# Altium project DriveTrainDaqBoard.PrjPcb
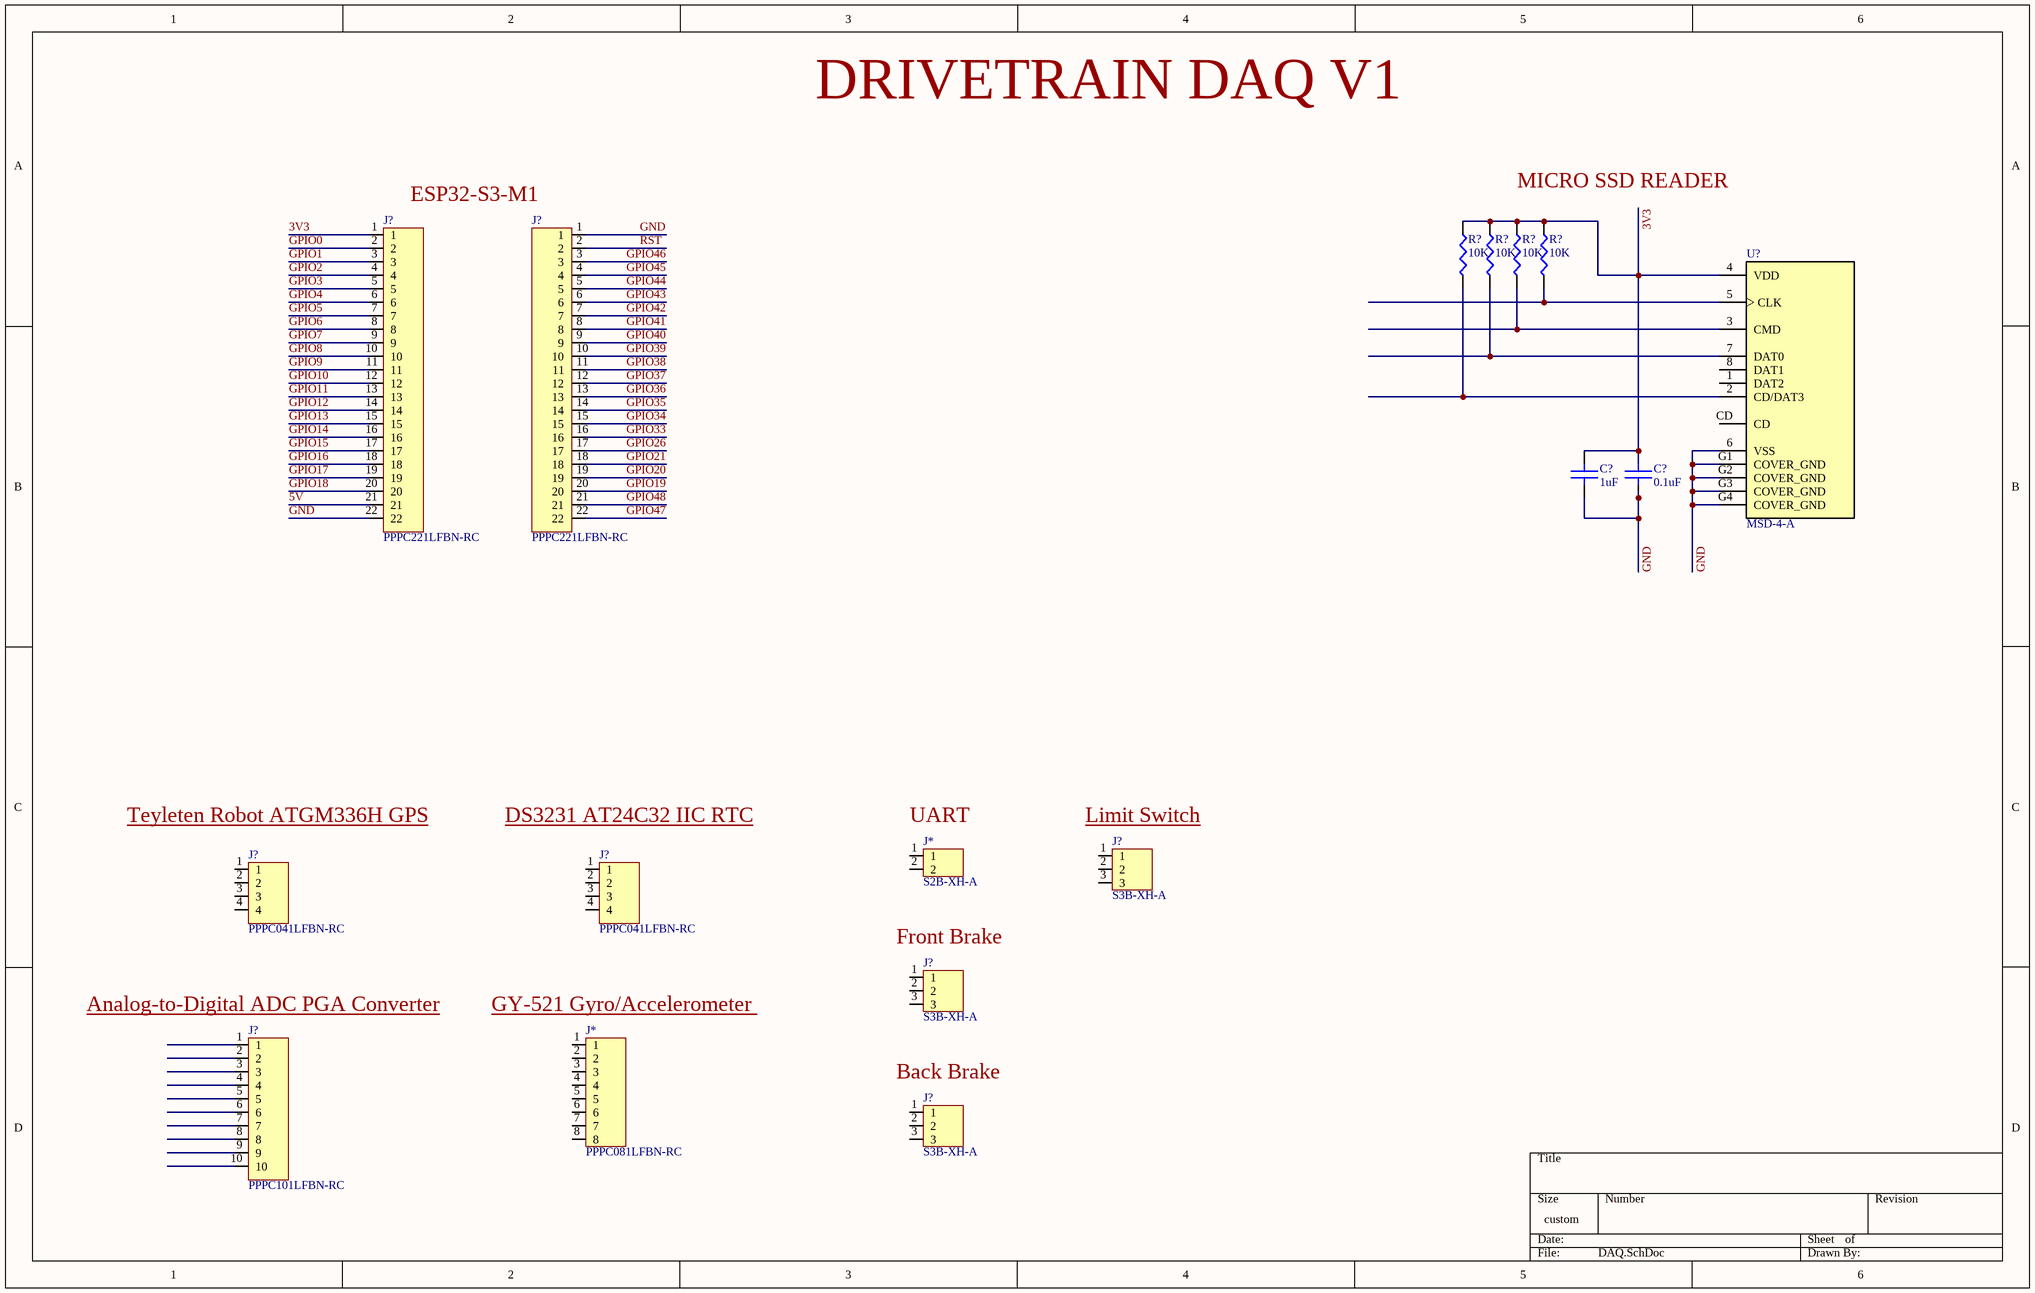
[diagram p0: DAQ.SchDoc]
1 sheet, 17 parts. Net scope: global (net labels, ports and power ports of the same name join across sheets).
Board file: DAQ.PcbDoc

## Sheet DAQ.SchDoc
size 381 x 241 mm; SheetNumber: 1; SheetTotal: 1

### Parts
(Parts that share a designator on the sheet are numbered #1, #2 ... from top to bottom, then left to right.)
C?#1  1uF  [CAPC1005X65N]
C?#2  0.1uF  [CAPC1005X65N]
J*#1  S2B-XH-A  [JST_S2B-XH-A]
J*#2  PPPC081LFBN-RC  [PPPC081LFBN-RC]
J?#1  PPPC221LFBN-RC  [PPPC221LFBN-RC]
J?#2  PPPC221LFBN-RC  [PPPC221LFBN-RC]
J?#3  S3B-XH-A  [JST_S3B-XH-A]
J?#4  S3B-XH-A  [JST_S3B-XH-A]
J?#5  PPPC041LFBN-RC  [PPPC041LFBN-RC]
J?#6  PPPC041LFBN-RC  [PPPC041LFBN-RC]
J?#7  S3B-XH-A  [JST_S3B-XH-A]
J?#8  PPPC101LFBN-RC  [PPPC101LFBN-RC]
R?#1  10K  [RESC1005X37N]
R?#2  10K  [RESC1005X37N]
R?#3  10K  [RESC1005X37N]
R?#4  10K  [RESC1005X37N]
U?  MSD-4-A  [CUI_MSD-4-A]

### Nets
3V3: C?#1.2 C?#2.2 J?#1.1 R?#1.2 R?#2.2 R?#3.2 R?#4.2 U?.4(VDD)
5V: J?#1.21
GND: C?#1.1 C?#2.1 J?#1.22 J?#2.1 U?.6(VSS) U?.G1(COVER_GND) U?.G2(COVER_GND) U?.G3(COVER_GND) U?.G4(COVER_GND)
GPIO0: J?#1.2
GPIO1: J?#1.3
GPIO2: J?#1.4
GPIO3: J?#1.5
GPIO4: J?#1.6
GPIO5: J?#1.7
GPIO6: J?#1.8
GPIO7: J?#1.9
GPIO8: J?#1.10
GPIO9: J?#1.11
GPIO10: J?#1.12
GPIO11: J?#1.13
GPIO12: J?#1.14
GPIO13: J?#1.15
GPIO14: J?#1.16
GPIO15: J?#1.17
GPIO16: J?#1.18
GPIO17: J?#1.19
GPIO18: J?#1.20
GPIO19: J?#2.20
GPIO20: J?#2.19
GPIO21: J?#2.18
GPIO26: J?#2.17
GPIO33: J?#2.16
GPIO34: J?#2.15
GPIO35: J?#2.14
GPIO36: J?#2.13
GPIO37: J?#2.12
GPIO38: J?#2.11
GPIO39: J?#2.10
GPIO40: J?#2.9
GPIO41: J?#2.8
GPIO42: J?#2.7
GPIO43: J?#2.6
GPIO44: J?#2.5
GPIO45: J?#2.4
GPIO46: J?#2.3
GPIO47: J?#2.22
GPIO48: J?#2.21
RST: J?#2.2
NetR?#1_1: R?#1.1 U?.2(CD/DAT3)
NetR?#2_1: R?#2.1 U?.7(DAT0)
NetR?#3_1: R?#3.1 U?.3(CMD)
NetR?#4_1: R?#4.1 U?.5(CLK)

Not connected (* = marked no-connect by the designer): J*#1 1 2; J*#2 1 2 3 4 5 6 7 8; J?#3 1 2 3; J?#4 1 2 3; J?#5 1 2 3 4; J?#6 1 2 3 4; J?#7 1 2 3; J?#8 1 2 3 4 5 6 7 8 9 10; U? 1(DAT2) 8(DAT1) CD

### Notes on the sheet
- DRIVETRAIN DAQ V1
- (near J?#1) ESP32-S3-M1
- (near R?#3) MICRO SSD READER
- (near J?#5) Teyleten Robot ATGM336H GPS <https://www.amazon.com/dp/B09LQDG1HY?ref=cm_sw_r_cso_cp_apin_dp_BQDS0HH5JQXGPHMCTJB1&ref_=cm_sw_r_cso_cp_apin_dp_BQDS0HH5JQXGPHMCTJB1&social_share=cm_sw_r_cso_cp_apin_dp_BQDS0HH5JQXGPHMCTJB1&titleSource=true>
- (near J?#6) DS3231 AT24C32 IIC RTC <https://www.amazon.com/dp/B07Q7NZTQS?ref=cm_sw_r_cso_cp_apin_dp_KZP2DNHVS5H5VK4BXDW1&ref_=cm_sw_r_cso_cp_apin_dp_KZP2DNHVS5H5VK4BXDW1&social_share=cm_sw_r_cso_cp_apin_dp_KZP2DNHVS5H5VK4BXDW1&titleSource=true&th=1>
- (near J*#1) UART
- (near J?#3) Limit Switch <https://a.co/d/0eUTMwXj>
- (near J?#4) Front Brake
- (near J?#8) Analog-to-Digital ADC PGA Converter <https://www.amazon.com/WWZMDiB-ADS1115-Converter-Raspberry-Experiments/dp/B0C8JFZ3D9>
- (near J*#2) GY-521 Gyro/Accelerometer <https://www.amazon.com/dp/B00LP25V1A?ref=cm_sw_r_cso_cp_apin_dp_01VYWEK9JFS8N8HQ5ARK&ref_=cm_sw_r_cso_cp_apin_dp_01VYWEK9JFS8N8HQ5ARK&social_share=cm_sw_r_cso_cp_apin_dp_01VYWEK9JFS8N8HQ5ARK&titleSource=true&th=1>
- (near J?#7) Back Brake

### Library data of the parts
C?#1 = CL05A105KO5NNNC: CAP CER 1UF 16V X5R 0402; Manufacturer: Samsung Electro-Mechanics; Value: 1µF; Dielectric Material: Ceramic; Tolerance: 10%; Supplier: DigiKey; Supplier Part Number: 1276-1067-1-ND; Manufacturer Part Number: CL05A105KO5NNNC; RoHS: Compliant; Category: Ceramic Capacitors; Stock: 473216; Pricing: 1=0.08, 10=0.006, 50=0.006 (USD); Case/Package: 0402; Case Code (Imperial): 0402; Case Code (Metric): 1005; China RoHS: Compliant; Contact Plating: Tin; Depth: 500µm; Dielectric: X5R; Height: 550µm; Length: 1mm; Lifecycle Status: Production; Material: Ceramic; Max Operating Temperature: 85°C; Min Operating Temperature: -55°C; Mounting Technology: Surface Mount; Number of Terminals: 2; Radiation Hardening: No; REACH SVHC: Yes; Schedule B: 8532240020, 8532240020|8532240020, 8532240020|8532240020|8532240020, 8532240020|8532240020|8532240020|8532240020; Thickness: 558.8µm; Voltage: 16V; Voltage Rating: 16V; Voltage Rating (DC): 16V; Width: 500µm; ComponentLink1URL: https://datasheet.octopart.com:443/CL05A105KO5NNNC-Samsung-Electro-Mechanics-datasheet-181960514.pdf?src-supplier=IHS; ComponentLink1Description: https://datasheet.octopart.com:443/CL05A105KO5NNNC-Samsung-Electro-Mechanics-datasheet-181960514.pdf?src-supplier=IHS; ComponentLink2URL: https://datasheet.octopart.com:443/CL05A105KO5NNNC-Samsung-Electro-Mechanics-datasheet-136031720.pdf?src-supplier=Samsung+SCT; ComponentLink2Description: https://datasheet.octopart.com:443/CL05A105KO5NNNC-Samsung-Electro-Mechanics-datasheet-136031720.pdf?src-supplier=Samsung+SCT; ComponentLink3URL: https://datasheet.octopart.com:443/CL05A105KO5NNNC-Samsung-Electro-Mechanics-datasheet-11776774.pdf?src-supplier=Future+Electronics; ComponentLink3Description: https://datasheet.octopart.com:443/CL05A105KO5NNNC-Samsung-Electro-Mechanics-datasheet-11776774.pdf?src-supplier=Future+Electronics; ComponentLink4URL: https://datasheet.octopart.com:443/CL05A105KO5NNNC-Samsung-Electro-Mechanics-datasheet-110226202.pdf?src-supplier=Future+Electronics; ComponentLink4Description: https://datasheet.octopart.com:443/CL05A105KO5NNNC-Samsung-Electro-Mechanics-datasheet-110226202.pdf?src-supplier=Future+Electronics; ComponentLink5URL: https://datasheet.octopart.com:443/CL05A105KO5NNNC-Samsung-Electro-Mechanics-datasheet-81461590.pdf?src-supplier=Future+Electronics; ComponentLink5Description: https://datasheet.octopart.com:443/CL05A105KO5NNNC-Samsung-Electro-Mechanics-datasheet-81461590.pdf?src-supplier=Future+Electronics; ComponentLink6URL: https://datasheet.octopart.com:443/CL05A105KO5NNNC-Samsung-datasheet-42280519.pdf?src-supplier=Future+Electronics; ComponentLink6Description: https://datasheet.octopart.com:443/CL05A105KO5NNNC-Samsung-datasheet-42280519.pdf?src-supplier=Future+Electronics; ComponentLink7URL: https://datasheet.octopart.com:443/CL05A105KO5NNNC-Samsung-datasheet-34152987.pdf?src-supplier=Future+Electronics; ComponentLink7Description: https://datasheet.octopart.com:443/CL05A105KO5NNNC-Samsung-datasheet-34152987.pdf?src-supplier=Future+Electronics; ComponentLink8URL: https://datasheet.octopart.com:443/CL05A105KO5NNNC-Samsung-datasheet-8329584.pdf?src-supplier=Future+Electronics; ComponentLink8Description: https://datasheet.octopart.com:443/CL05A105KO5NNNC-Samsung-datasheet-8329584.pdf?src-supplier=Future+Electronics; ComponentLink9URL: https://datasheet.octopart.com:443/CL05A105KO5NNNC-Samsung-Electro-Mechanics-datasheet-149136633.pdf?src-supplier=Future+Electronics; ComponentLink9Description: https://datasheet.octopart.com:443/CL05A105KO5NNNC-Samsung-Electro-Mechanics-datasheet-149136633.pdf?src-supplier=Future+Electronics; ComponentLink10URL: https://datasheet.octopart.com/CL05A105KO5NNNC-Samsung-Electro-Mechanics-datasheet-97040617.pdf; ComponentLink10Description: https://datasheet.octopart.com/CL05A105KO5NNNC-Samsung-Electro-Mechanics-datasheet-97040617.pdf; ComponentLink11URL: https://datasheet.octopart.com/CL05A105KO5NNNC-Samsung-Electro-Mechanics-datasheet-8324245.pdf; ComponentLink11Description: https://datasheet.octopart.com/CL05A105KO5NNNC-Samsung-Electro-Mechanics-datasheet-8324245.pdf; ComponentLink12URL: https://datasheet.octopart.com/General-Multilayer-Ceramic-Capacitors-Samsung-datasheet-family-111.pdf; ComponentLink12Description: https://datasheet.octopart.com/General-Multilayer-Ceramic-Capacitors-Samsung-datasheet-family-111.pdf; ComponentLink13URL: https://datasheet.octopart.com:443/CL05A105KO5NNNC-Samsung-datasheet-59220082.pdf?src-supplier=TME; ComponentLink13Description: https://datasheet.octopart.com:443/CL05A105KO5NNNC-Samsung-datasheet-59220082.pdf?src-supplier=TME; ComponentLink14URL: http://sigma.octopart.com:80/rohs_certificate/General-Multilayer-Ceramic-Capacitors-Samsung-family-110.pdf?src-supplier=Compliance+Statements; ComponentLink14Description: http://sigma.octopart.com:80/rohs_certificate/General-Multilayer-Ceramic-Capacitors-Samsung-family-110.pdf?src-supplier=Compliance+Statements; ComponentLink15URL: http://sigma.octopart.com:80/rohs_statement/General-Multilayer-Ceramic-Capacitors-Samsung-family-132.pdf?src-supplier=Compliance+Statements; ComponentLink15Description: http://sigma.octopart.com:80/rohs_statement/General-Multilayer-Ceramic-Capacitors-Samsung-family-132.pdf?src-supplier=Compliance+Statements; ComponentLink16URL: http://sigma.octopart.com:80/reach_statement/General-Multilayer-Ceramic-Capacitors-Samsung-family-133.pdf?src-supplier=Compliance+Statements; ComponentLink16Description: http://sigma.octopart.com:80/reach_statement/General-Multilayer-Ceramic-Capacitors-Samsung-family-133.pdf?src-supplier=Compliance+Statements; LCSC Part Number: C29266
C?#2 = CL05B104KB5NNNC: CAP CER 0.1UF 50V X7R 0402; Manufacturer: Samsung Electro-Mechanics; Value: 100nF; Dielectric Material: Ceramic; Tolerance: 10%; Supplier: DigiKey; Supplier Part Number: 1276-CL05B104KB5NNNCCT-ND; Manufacturer Part Number: CL05B104KB5NNNC; RoHS: Compliant; Category: Ceramic Capacitors; Stock: 758316; Pricing: 1=0.08, 10=0.010, 50=0.0088, 100=0.008 (USD); Case/Package: 0402; China RoHS: Compliant; Dielectric: X7R; Height: 550µm; Lifecycle Status: Production; Material: Ceramic; Max Operating Temperature: 125°C; Min Operating Temperature: -55°C; Mounting Technology: Surface Mount; Number of Terminals: 2; REACH SVHC: Yes; Voltage Rating: 50V; Voltage Rating (DC): 50V; ComponentLink1URL: https://datasheet.octopart.com:443/CL05B104KB5NNNC-Samsung-Electro-Mechanics-datasheet-141346860.pdf?src-supplier=IHS; ComponentLink1Description: https://datasheet.octopart.com:443/CL05B104KB5NNNC-Samsung-Electro-Mechanics-datasheet-141346860.pdf?src-supplier=IHS; ComponentLink2URL: https://datasheet.octopart.com:443/CL05B104KB5NNNC-Samsung-datasheet-97040617.pdf?src-supplier=Future+Electronics; ComponentLink2Description: https://datasheet.octopart.com:443/CL05B104KB5NNNC-Samsung-datasheet-97040617.pdf?src-supplier=Future+Electronics; ComponentLink3URL: https://datasheet.octopart.com:443/CL05B104KB5NNNC-Samsung-datasheet-8326407.pdf?src-supplier=TME; ComponentLink3Description: https://datasheet.octopart.com:443/CL05B104KB5NNNC-Samsung-datasheet-8326407.pdf?src-supplier=TME; LCSC Part Number: C960916; Parameter 2: *
J*#1 = S2B-XH-A: Board Connector, 2 Contact(s), 1 Row(s), Male, Right Angle, Solder Terminal; Manufacturer: JST; Contact Resistance: 20mΩ; Current Rating: 3A; Insulation Resistance: 1GΩ; Number of Poles: 2; Pitch: 2.5mm; Supplier: DigiKey; Supplier Part Number: 455-S2B-XH-A-ND; Manufacturer Part Number: S2B-XH-A; RoHS: Compliant; Category: Card Edge Connectors; Stock: 27070; Pricing: 1=0.14, 10=0.12, 100=0.1019, 500=0.09094, 1000=0.08658, 5000=0.07728, 10000=0.07359 (USD); Color: White; Contact Material: Bronze; Contact Plating: Copper, Lead, Tin; Export Control Classification Number (ECCN) Code: EAR99; Gender: Male; Height: 6.1mm; Harmonized Tariff Schedule (HTS) Code: 8536.69.40.40; Introduction Date: 1997-11-01; Length: 7.4mm; Lifecycle Status: Production; Max Operating Temperature: 85°C; Min Operating Temperature: -25°C; Mounting Technology: Through Hole; Number of Positions: 2; Number of Rows: 1; Terminal Pitch: 2.5mm; Width: 11.5mm; ComponentLink1URL: https://datasheet.octopart.com:443/S2B-XH-A-JST-datasheet-157850277.pdf?src-supplier=IHS; ComponentLink1Description: https://datasheet.octopart.com:443/S2B-XH-A-JST-datasheet-157850277.pdf?src-supplier=IHS
J*#2 = PPPC081LFBN-RC: CONN HDR 8POS 0.1 GOLD PCB; Manufacturer: Sullins; Description: Female, 8C, Straight, .100"CC; 3.20mm Tail, No Mounting; PBT, Phos. Bronze, 105 C; Connector Type: Header, Socket; Current Rating: 3A; Dielectric Material: Polyester; Gender: Female; Number of Contacts: 8; Pitch: 2.54mm; Voltage Rating: 250V; Supplier: DigiKey; Supplier Part Number: S7041-ND; Manufacturer Part Number: PPPC081LFBN-RC; RoHS: Compliant; Category: Headers and Wire Housings; Stock: 10969; Pricing: 1=0.6, 10=0.509, 100=0.4323, 500=0.38584, 1000=0.3674, 5000=0.32795, 10000=0.31231 (USD); Case/Package: TO-252-3; Color: Black; Contact Material: Gold, Nickel; Contact Plating: Gold; Export Control Classification Number (ECCN) Code: EAR99; Height: 2.39mm; Housing Material: Plastic; Harmonized Tariff Schedule (HTS) Code: 8536.69.40.40; Introduction Date: 2008-05-14; Lead Free: Lead Free; Length: 6.73mm; Lifecycle Status: Production; Max Operating Temperature: 105°C; Min Operating Temperature: -40°C; Mounting Technology: Surface Mount; Number of Positions: 8; Number of Rows: 1; Packaging: Tape and Reel; Radiation Hardening: No; REACH SVHC: Yes; Terminal Pitch: 2.54mm; Termination: Solder; Width: 6.22mm; ComponentLink1URL: https://datasheet.octopart.com:443/PPPC081LFBN-RC-Sullins-datasheet-138810743.pdf?src-supplier=IHS; ComponentLink1Description: https://datasheet.octopart.com:443/PPPC081LFBN-RC-Sullins-datasheet-138810743.pdf?src-supplier=IHS; ComponentLink2URL: https://datasheet.octopart.com:443/PPPC081LFBN-RC-Sullins-datasheet-41308905.pdf?src-supplier=Upverter; ComponentLink2Description: https://datasheet.octopart.com:443/PPPC081LFBN-RC-Sullins-datasheet-41308905.pdf?src-supplier=Upverter; ComponentLink3URL: https://sigma.octopart.com:443/83216130/technical_drawing/Sullins-PPPC081LFBN-RC.pdf?src-supplier=Upverter; ComponentLink3Description: https://sigma.octopart.com:443/83216130/technical_drawing/Sullins-PPPC081LFBN-RC.pdf?src-supplier=Upverter; ComponentLink4URL: https://datasheet.octopart.com:443/PPPC081LFBN-RC-Sullins-datasheet-12511165.pdf?src-supplier=Future+Electronics; ComponentLink4Description: https://datasheet.octopart.com:443/PPPC081LFBN-RC-Sullins-datasheet-12511165.pdf?src-supplier=Future+Electronics
J?#1 J?#2 = PPPC221LFBN-RC: 22 Position 1 Row 2.54 mm Pitch Through Hole Female Socket Through Hole Header; Manufacturer: Sullins; Connector Type: Header, Socket; Current Rating: 3A; Dielectric Material: Polyester; Number of Positions: 22; Pitch: 2.54mm; Supplier: DigiKey; Supplier Part Number: S7055-ND; Manufacturer Part Number: PPPC221LFBN-RC; RoHS: Compliant; Category: Card Edge Connectors; Stock: 1982; Pricing: 1=1.24, 10=1.056, 100=0.8975, 500=0.8011, 1000=0.76285, 5000=0.6994 (USD); Color: Black; Contact Gender: Female; Contact Material: Bronze; Contact Plating: Gold; Height: 8.5mm; Housing Material: Plastic; Lead Free: Lead Free; Length: 56.4mm; Lifecycle Status: Production; Mounting Technology: Through Hole; Pins: 22; Number of Rows: 1; Packaging: Bulk; REACH SVHC: Yes; Terminal Pitch: 2.54mm; Termination: Solder; Width: 2.5mm; ComponentLink1URL: https://datasheet.octopart.com:443/PPPC221LFBN-RC-Sullins-datasheet-138810743.pdf?src-supplier=IHS; ComponentLink1Description: https://datasheet.octopart.com:443/PPPC221LFBN-RC-Sullins-datasheet-138810743.pdf?src-supplier=IHS; ComponentLink2URL: https://datasheet.octopart.com:443/PPPC221LFBN-RC-Sullins-datasheet-47864048.pdf?src-supplier=Future+Electronics; ComponentLink2Description: https://datasheet.octopart.com:443/PPPC221LFBN-RC-Sullins-datasheet-47864048.pdf?src-supplier=Future+Electronics; ComponentLink3URL: https://datasheet.octopart.com:443/PPPC221LFBN-RC-Sullins-datasheet-12511165.pdf?src-supplier=Factory+Futures; ComponentLink3Description: https://datasheet.octopart.com:443/PPPC221LFBN-RC-Sullins-datasheet-12511165.pdf?src-supplier=Factory+Futures
J?#3 J?#4 J?#7 = S3B-XH-A: Board Connector, 3 Contact(s), 1 Row(s), Male, Right Angle, Solder Terminal; Manufacturer: JST; Contact Resistance: 20mΩ; Current Rating: 3A; Insulation Resistance: 1GΩ; Number of Contacts: 3; Supplier: DigiKey; Supplier Part Number: 455-S3B-XH-A-ND; Manufacturer Part Number: S3B-XH-A; RoHS: Compliant; Category: Card Edge Connectors; Stock: 62900; Pricing: 1=0.15, 10=0.126, 100=0.1068, 500=0.09526, 1000=0.09071, 5000=0.08096, 10000=0.07709 (USD); Contact Gender: Male; Contact Material: Brass; Contact Plating: Tin; Gender: Male; Lifecycle Status: Production; Max Operating Temperature: 85°C; Min Operating Temperature: -25°C; Pins: 3; Number of Rows: 1; REACH SVHC: No; Terminal Pitch: 2.5mm; Termination: Through Hole; ComponentLink1URL: https://datasheet.octopart.com:443/S3B-XH-A-JST-datasheet-157850277.pdf?src-supplier=IHS; ComponentLink1Description: https://datasheet.octopart.com:443/S3B-XH-A-JST-datasheet-157850277.pdf?src-supplier=IHS; ComponentLink2URL: https://datasheet.octopart.com:443/S3B-XH-A-JST-datasheet-10026044.pdf?src-supplier=element14+APAC; ComponentLink2Description: https://datasheet.octopart.com:443/S3B-XH-A-JST-datasheet-10026044.pdf?src-supplier=element14+APAC
J?#5 J?#6 = PPPC041LFBN-RC: Conn Socket Strip F 4 POS 2.54mm Solder ST Top Entry Thru-Hole; Manufacturer: Sullins; Connector Type: Header, Socket; Current Rating: 3A; Dielectric Material: Polyester; Number of Positions: 4; Supplier: DigiKey; Supplier Part Number: S7037-ND; Manufacturer Part Number: PPPC041LFBN-RC; RoHS: Compliant; Category: Card Edge Connectors; Stock: 30890; Pricing: 1=0.38, 10=0.321, 100=0.2724, 500=0.24312, 1000=0.23151, 5000=0.20664, 10000=0.19678 (USD); Color: Black; Contact Gender: Female; Contact Material: Bronze; Contact Plating: Gold; Height: 8.5mm; Housing Material: Plastic; Lead Free: Lead Free; Length: 10.7mm; Lifecycle Status: Production; Mounting Technology: Through Hole; Pins: 4; Number of Rows: 1; Packaging: Bulk; Pitch: 2.54mm; REACH SVHC: Yes; Terminal Pitch: 2.54mm; Termination: Solder; Width: 2.5mm; ComponentLink1URL: https://datasheet.octopart.com:443/PPPC041LFBN-RC-Sullins-datasheet-138810743.pdf?src-supplier=IHS; ComponentLink1Description: https://datasheet.octopart.com:443/PPPC041LFBN-RC-Sullins-datasheet-138810743.pdf?src-supplier=IHS; ComponentLink2URL: https://datasheet.octopart.com:443/PPPC041LFBN-RC-Sullins-datasheet-41308905.pdf?src-supplier=Future+Electronics; ComponentLink2Description: https://datasheet.octopart.com:443/PPPC041LFBN-RC-Sullins-datasheet-41308905.pdf?src-supplier=Future+Electronics; ComponentLink3URL: https://datasheet.octopart.com:443/PPPC041LFBN-RC-Sullins-datasheet-12511165.pdf?src-supplier=Future+Electronics; ComponentLink3Description: https://datasheet.octopart.com:443/PPPC041LFBN-RC-Sullins-datasheet-12511165.pdf?src-supplier=Future+Electronics
J?#8 = PPPC101LFBN-RC: Conn Socket Strip F 10 POS 2.54mm Solder ST Top Entry Thru-Hole; Manufacturer: Sullins; Connector Type: Header, Socket; Current Rating: 3A; Dielectric Material: Polyester; Number of Contacts: 10; Voltage Rating: 250V; Supplier: DigiKey; Supplier Part Number: S7043-ND; Manufacturer Part Number: PPPC101LFBN-RC; RoHS: Compliant; Category: Card Edge Connectors; Stock: 25256; Pricing: 1=0.58, 10=0.493, 100=0.4193, 500=0.37422, 1000=0.35634, 5000=0.31808, 10000=0.3042 (USD); Color: Black; Contact Gender: Female; Contact Material: Gold, Nickel; Contact Plating: Gold; Height: 8.7mm; Housing Material: Plastic; Lead Free: Lead Free; Length: 25.9mm; Lifecycle Status: Production; Max Operating Temperature: 105°C; Min Operating Temperature: -40°C; Mounting Technology: Through Hole; Pins: 10; Number of Positions: 10; Number of Rows: 1; Packaging: Bulk; Pitch: 2.54mm; REACH SVHC: Yes; Terminal Pitch: 2.54mm; Termination: Solder; Width: 2.5mm; ComponentLink1URL: https://datasheet.octopart.com:443/PPPC101LFBN-RC-Sullins-datasheet-138810743.pdf?src-supplier=IHS; ComponentLink1Description: https://datasheet.octopart.com:443/PPPC101LFBN-RC-Sullins-datasheet-138810743.pdf?src-supplier=IHS; ComponentLink2URL: https://sigma.octopart.com:443/83216130/technical_drawing/Sullins-PPPC101LFBN-RC.pdf?src-supplier=Upverter; ComponentLink2Description: https://sigma.octopart.com:443/83216130/technical_drawing/Sullins-PPPC101LFBN-RC.pdf?src-supplier=Upverter; ComponentLink3URL: https://datasheet.octopart.com:443/PPPC101LFBN-RC-Sullins-datasheet-41308905.pdf?src-supplier=Future+Electronics; ComponentLink3Description: https://datasheet.octopart.com:443/PPPC101LFBN-RC-Sullins-datasheet-41308905.pdf?src-supplier=Future+Electronics; ComponentLink4URL: https://datasheet.octopart.com:443/PPPC101LFBN-RC-Sullins-datasheet-12511165.pdf?src-supplier=Future+Electronics; ComponentLink4Description: https://datasheet.octopart.com:443/PPPC101LFBN-RC-Sullins-datasheet-12511165.pdf?src-supplier=Future+Electronics
R?#1-R?#4 = RC0402FR-0710KL: RES 10K OHM 1% 1/16W 0402; Manufacturer: Yageo Group; Power Dissipation: 62.5mW; Power Rating: 63mW; Value: 10kΩ; Temperature Coefficient: 100ppm/°C; Voltage Rating: 50V; Supplier: DigiKey; Supplier Part Number: 311-10.0KLRCT-ND; Manufacturer Part Number: RC0402FR-0710KL; RoHS: Compliant; Category: Chip SMD Resistors; Stock: 9783461; Pricing: 1=0.1, 10=0.02, 25=0.014, 50=0.0112, 100=0.009, 250=0.00688, 500=0.00566, 1000=0.00474, 5000=0.00328, 10000=0.00286, 20000=0.00253, 30000=0.00237, 50000=0.0022, 70000=0.0021, 100000=0.002, 120000=0.00196, 240000=0.00182, 250000=0.00181 (USD); Case/Package: 0402; Case Code (Imperial): 0402; Case Code (Metric): 0402; China RoHS: Non-Compliant; Composition: Thick Film; Depth: 500µm; Height: 350µm; Lead Free: Lead Free; Lead Pitch: 200µm; Length: 1mm; Lifecycle Status: Production; Max Operating Temperature: 155°C; Military Standard: Not; Min Operating Temperature: -55°C; Mounting Technology: Surface Mount; Pins: 2; Number of Terminals: 2; Number of Terminations: 2; Packaging: Tape & Reel; REACH SVHC: Yes; Schedule B: 8533210045, 8533210045|8533210045|8533210045|8533210045|8533210045|8533210045|8533210045|8533210045|8533210045|8533210045|8533210045|8533210045|8533210045|8533210045, 8533210045|8533210045|8533210045|8533210045|8533210045|8533210045|8533210045|8533210045|8533210045|8533210045|8533210045|8533210045|8533210045|8533210045|8533210045, 8533210045|8533210045|8533210045|8533210045|8533210045|8533210045|8533210045|8533210045|8533210045|8533210045|8533210045|8533210045|8533210045|8533210045|8533210045|8533210045; Termination: SMD/SMT; Tolerance: 1%; Voltage Rating (DC): 50V; Width: 500µm; Working Voltage: 50V; ComponentLink1URL: https://datasheet.octopart.com:443/RC0402FR-0710KL-Yageo-datasheet-175887523.pdf?src-supplier=Newark; ComponentLink1Description: https://datasheet.octopart.com:443/RC0402FR-0710KL-Yageo-datasheet-175887523.pdf?src-supplier=Newark; ComponentLink2URL: https://datasheet.octopart.com:443/RC0402FR-0710KL-Yageo-datasheet-12531192.pdf?src-supplier=Newark; ComponentLink2Description: https://datasheet.octopart.com:443/RC0402FR-0710KL-Yageo-datasheet-12531192.pdf?src-supplier=Newark; ComponentLink3URL: https://datasheet.octopart.com:443/RC0402FR-0710KL-Yageo-datasheet-8324527.pdf?src-supplier=Newark; ComponentLink3Description: https://datasheet.octopart.com:443/RC0402FR-0710KL-Yageo-datasheet-8324527.pdf?src-supplier=Newark; ComponentLink4URL: https://datasheet.octopart.com:443/RC0402FR-0710KL-Yageo-datasheet-10408619.pdf?src-supplier=element14+APAC; ComponentLink4Description: https://datasheet.octopart.com:443/RC0402FR-0710KL-Yageo-datasheet-10408619.pdf?src-supplier=element14+APAC; ComponentLink5URL: https://datasheet.octopart.com:443/RC0402FR-0710KL-Yageo-datasheet-62067350.pdf?src-supplier=element14+APAC; ComponentLink5Description: https://datasheet.octopart.com:443/RC0402FR-0710KL-Yageo-datasheet-62067350.pdf?src-supplier=element14+APAC; ComponentLink6URL: https://datasheet.octopart.com:443/RC0402FR-0710KL-Yageo-datasheet-21426659.pdf?src-supplier=element14+APAC; ComponentLink6Description: https://datasheet.octopart.com:443/RC0402FR-0710KL-Yageo-datasheet-21426659.pdf?src-supplier=element14+APAC; ComponentLink7URL: https://datasheet.octopart.com:443/RC0402FR-0710KL-Yageo-datasheet-164759695.pdf?src-supplier=Upverter; ComponentLink7Description: https://datasheet.octopart.com:443/RC0402FR-0710KL-Yageo-datasheet-164759695.pdf?src-supplier=Upverter; ComponentLink8URL: https://datasheet.octopart.com:443/RC0402FR-0710KL-Yageo-datasheet-103092701.pdf?src-supplier=Upverter; ComponentLink8Description: https://datasheet.octopart.com:443/RC0402FR-0710KL-Yageo-datasheet-103092701.pdf?src-supplier=Upverter; ComponentLink9URL: https://sigma.octopart.com:443/138820526/technical_drawing/Yageo-RC0402FR-0710KL.pdf?src-supplier=Upverter; ComponentLink9Description: https://sigma.octopart.com:443/138820526/technical_drawing/Yageo-RC0402FR-0710KL.pdf?src-supplier=Upverter; ComponentLink10URL: https://datasheet.octopart.com:443/RC0402FR-0710KL-Yageo-datasheet-98239111.pdf?src-supplier=Upverter; ComponentLink10Description: https://datasheet.octopart.com:443/RC0402FR-0710KL-Yageo-datasheet-98239111.pdf?src-supplier=Upverter; ComponentLink11URL: https://datasheet.octopart.com:443/RC0402FR-0710KL-Yageo-datasheet-68298067.pdf?src-supplier=Upverter; ComponentLink11Description: https://datasheet.octopart.com:443/RC0402FR-0710KL-Yageo-datasheet-68298067.pdf?src-supplier=Upverter; ComponentLink12URL: https://datasheet.octopart.com:443/RC0402FR-0710KL-Yageo-datasheet-68297981.pdf?src-supplier=Upverter; ComponentLink12Description: https://datasheet.octopart.com:443/RC0402FR-0710KL-Yageo-datasheet-68297981.pdf?src-supplier=Upverter; ComponentLink13URL: https://datasheet.octopart.com:443/RC0402FR-0710KL-Yageo-datasheet-141435361.pdf?src-supplier=Upverter; ComponentLink13Description: https://datasheet.octopart.com:443/RC0402FR-0710KL-Yageo-datasheet-141435361.pdf?src-supplier=Upverter; ComponentLink14URL: https://datasheet.octopart.com:443/RC0402FR-0710KL-Yageo-datasheet-12509768.pdf?src-supplier=Upverter; ComponentLink14Description: https://datasheet.octopart.com:443/RC0402FR-0710KL-Yageo-datasheet-12509768.pdf?src-supplier=Upverter; ComponentLink15URL: https://datasheet.octopart.com:443/RC0402FR-0710KL-Yageo-datasheet-8329306.pdf?src-supplier=element14; ComponentLink15Description: https://datasheet.octopart.com:443/RC0402FR-0710KL-Yageo-datasheet-8329306.pdf?src-supplier=element14; ComponentLink16URL: https://datasheet.octopart.com:443/RC0402FR-0710KL-Yageo-datasheet-505231.pdf?src-supplier=element14; ComponentLink16Description: https://datasheet.octopart.com:443/RC0402FR-0710KL-Yageo-datasheet-505231.pdf?src-supplier=element14; ComponentLink17URL: https://datasheet.octopart.com:443/RC0402FR-0710KL-Yageo-datasheet-175423674.pdf?src-supplier=SOS+electronic; ComponentLink17Description: https://datasheet.octopart.com:443/RC0402FR-0710KL-Yageo-datasheet-175423674.pdf?src-supplier=SOS+electronic; ComponentLink18URL: https://datasheet.octopart.com:443/RC0402FR-0710KL-Yageo-datasheet-137700087.pdf?src-supplier=Future+Electronics; ComponentLink18Description: https://datasheet.octopart.com:443/RC0402FR-0710KL-Yageo-datasheet-137700087.pdf?src-supplier=Future+Electronics; ComponentLink19URL: https://datasheet.octopart.com:443/RC0402FR-0710KL-Yageo-datasheet-8324255.pdf?src-supplier=Future+Electronics; ComponentLink19Description: https://datasheet.octopart.com:443/RC0402FR-0710KL-Yageo-datasheet-8324255.pdf?src-supplier=Future+Electronics; ComponentLink20URL: https://datasheet.octopart.com:443/RC0402FR-0710KL-Yageo-datasheet-79472498.pdf?src-supplier=Megastar; ComponentLink20Description: https://datasheet.octopart.com:443/RC0402FR-0710KL-Yageo-datasheet-79472498.pdf?src-supplier=Megastar; ComponentLink21URL: https://datasheet.octopart.com/RC0402FR-0710KL-Yageo-datasheet-73766026.pdf; ComponentLink21Description: https://datasheet.octopart.com/RC0402FR-0710KL-Yageo-datasheet-73766026.pdf; ComponentLink22URL: http://sigma.octopart.com:80/rohs_statement/Yageo-company-2.pdf?src-supplier=Compliance+Statements; ComponentLink22Description: http://sigma.octopart.com:80/rohs_statement/Yageo-company-2.pdf?src-supplier=Compliance+Statements; ComponentLink23URL: http://sigma.octopart.com:80/conflict_mineral_statement/Yageo-company-3.pdf?src-supplier=Compliance+Statements; ComponentLink23Description: http://sigma.octopart.com:80/conflict_mineral_statement/Yageo-company-3.pdf?src-supplier=Compliance+Statements; LCSC Part Number: C60490; Supplier 1: Newark; Supplier Part Number 1: 75X0131
U? = MSD-4-A: Memory & Sim Conn, Micro Sd, 9P, Push in Rohs Compliant: Yes; Manufacturer: Same Sky; Number of Contacts: 9; Supplier: DigiKey; Supplier Part Number: 2223-MSD-4-ACT-ND; Manufacturer Part Number: MSD-4-A; RoHS: Compliant; Category: Card Edge Connectors; Stock: 19060; Pricing: 1=0.36, 10=0.318, 25=0.3036, 50=0.2926, 100=0.2822, 250=0.26896, 500=0.25938 (USD); Lifecycle Status: Production; REACH SVHC: Yes; ComponentLink1URL: https://datasheet.octopart.com:443/MSD-4-A-Same-Sky-datasheet-188826395.pdf?src-supplier=Same+Sky; ComponentLink1Description: https://datasheet.octopart.com:443/MSD-4-A-Same-Sky-datasheet-188826395.pdf?src-supplier=Same+Sky; ComponentLink2URL: https://datasheet.octopart.com:443/MSD-4-A-Same-Sky-datasheet-181916841.pdf?src-supplier=Same+Sky; ComponentLink2Description: https://datasheet.octopart.com:443/MSD-4-A-Same-Sky-datasheet-181916841.pdf?src-supplier=Same+Sky; ComponentLink3URL: https://datasheet.octopart.com:443/MSD-4-A-Same-Sky-datasheet-181916843.pdf?src-supplier=Same+Sky; ComponentLink3Description: https://datasheet.octopart.com:443/MSD-4-A-Same-Sky-datasheet-181916843.pdf?src-supplier=Same+Sky; ComponentLink4URL: https://datasheet.octopart.com:443/MSD-4-A-Same-Sky-datasheet-190142353.pdf?src-supplier=element14+APAC; ComponentLink4Description: https://datasheet.octopart.com:443/MSD-4-A-Same-Sky-datasheet-190142353.pdf?src-supplier=element14+APAC; ComponentLink5URL: https://datasheet.octopart.com:443/MSD-4-A-Same-Sky-datasheet-187906758.pdf?src-supplier=Master+Electronics; ComponentLink5Description: https://datasheet.octopart.com:443/MSD-4-A-Same-Sky-datasheet-187906758.pdf?src-supplier=Master+Electronics; ComponentLink6URL: https://datasheet.octopart.com:443/MSD-4-A-Same-Sky-datasheet-189105038.pdf?src-supplier=Master+Electronics; ComponentLink6Description: https://datasheet.octopart.com:443/MSD-4-A-Same-Sky-datasheet-189105038.pdf?src-supplier=Master+Electronics; ComponentLink7URL: https://octopart.com:443/opatz8j6/c1?t=OklLJ3Cn6EJ58qiIsR4ETs59k0pdJoySAJ4KZqxoiusSZQYTb9S8pusi1kgkJn5eC7RsB0VALl2X_PnRwtqyvDB9WfpMQgoLmisnEu2FRjVmus4JdyiPcntT2ElvTa2Of7vsKFoACo-SfHWnp4OJdzR1DmxOxBkV3iRUkF5aYH_v20eMe6qpQUN2qCpoFUDPB6zoA_4aKyXfpmhYkePRKBkS7QLt_3LdaQQnbCvF_fANTX1CXXfyg_7OR_j_j_PKcPm-CB_VFeBUVIiUCcoA-Sa0tfkOnAOTqaF891NWlGE7F92Bh78ecS-7oOS_kN434D-9grUeGaxT0KruoTvjdSNsUoxpTdBTUQ&src-supplier=Compliance+Statements; ComponentLink7Description: https://octopart.com:443/opatz8j6/c1?t=OklLJ3Cn6EJ58qiIsR4ETs59k0pdJoySAJ4KZqxoiusSZQYTb9S8pusi1kgkJn5eC7RsB0VALl2X_PnRwtqyvDB9WfpMQgoLmisnEu2FRjVmus4JdyiPcntT2ElvTa2Of7vsKFoACo-SfHWnp4OJdzR1DmxOxBkV3iRUkF5aYH_v20eMe6qpQUN2qCpoFUDPB6zoA_4aKyXfpmhYkePRKBkS7QLt_3LdaQQnbCvF_fANTX1CXXfyg_7OR_j_j_PKcPm-CB_VFeBUVIiUCcoA-Sa0tfkOnAOTqaF891NWlGE7F92Bh78ecS-7oOS_kN434D-9grUeGaxT0KruoTvjdSNsUoxpTdBTUQ&src-supplier=Compliance+Statements; ComponentLink8URL: https://octopart.com:443/opatz8j6/c1?t=56VKgEEM5Ew_b_00VnAHw7m7J80biGly62Ot5MveOjJfWQiiiFo75OsdVL3D4ctiIjdn5qZd2GKSn4ysF2A2X9SB5PMX9rtFMLqOLzabYRrLW1sdJvZjNYOtT52_2pyWzszDwX6GT9AuysY_Kac0kr-nKqmfJaGQBFJ4GnLzMHt7nU83_GCq3q5bnzZvOe8VO7x6awYehHWuDfbSZSptEeVzJv9jqL2KHhRIzyb0l4El-_pmLBmXLl8q6t2RCz32btwZwTVfma5VOd_HWAJjK0S5XNNJTFLCtN6-e-vJLnB3S9C8OJldtEio3ep_838gUXxW9g0B7S6xUQkW2QSr6mdT9vw6YhCHQg&src-supplier=Compliance+Statements; ComponentLink8Description: https://octopart.com:443/opatz8j6/c1?t=56VKgEEM5Ew_b_00VnAHw7m7J80biGly62Ot5MveOjJfWQiiiFo75OsdVL3D4ctiIjdn5qZd2GKSn4ysF2A2X9SB5PMX9rtFMLqOLzabYRrLW1sdJvZjNYOtT52_2pyWzszDwX6GT9AuysY_Kac0kr-nKqmfJaGQBFJ4GnLzMHt7nU83_GCq3q5bnzZvOe8VO7x6awYehHWuDfbSZSptEeVzJv9jqL2KHhRIzyb0l4El-_pmLBmXLl8q6t2RCz32btwZwTVfma5VOd_HWAJjK0S5XNNJTFLCtN6-e-vJLnB3S9C8OJldtEio3ep_838gUXxW9g0B7S6xUQkW2QSr6mdT9vw6YhCHQg&src-supplier=Compliance+Statements